# Altium schematic sheet IMU.SchDoc
size A; SheetNumber: 4; SheetTotal: 5
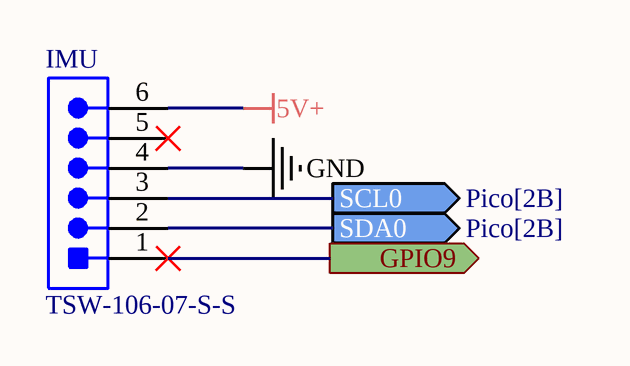
[diagram p0: IMU.SchDoc]

## Parts
IMU  TSW-106-07-S-S  [SMTC-TSW-106-07-S-S_V]

## Ports
GPIO9 (out), SCL0 (out, see Pico[2B]), SDA0 (out, see Pico[2B])

## Nets
5V+: IMU.6
GND: IMU.4
GPIO9: IMU.1 ; port GPIO9
SCL0: IMU.3 ; port SCL0
SDA0: IMU.2 ; port SDA0

Not connected (* = marked no-connect by the designer): IMU 5*

## Library data of the parts
IMU = CMP-1681-00007-2: Male Header, Pitch 2.54 mm, 1 x 6 Position, Height 8.38 mm, Tail Length 2.54 mm, -55 to 125 degC, RoHS, Bulk; Manufacturer: Samtec; Rows: 1; Contact Finish: Gold; Lead Pitch: 0.1 inch; Package Quantity: 1; Mounting Technology: Through Hole; ComponentLink1Description: Manufacturer URL; Contact Plating: Gold; DatasheetVersion: 12/2015; ComponentLink3Description: Package Specification; PackageDescription: Male Header, Pitch 2.54 mm, 1 x 6 Position, Height 8.38 mm, Tail Length 2.54 mm; Height: 8.38 mm; ComponentLink2Description: Datasheet; RoHSCompliant: true; Colour: Black; Packaging: Bulk; Min Operating Temperature: -55 degC; ComponentLink2URL: http://suddendocs.samtec.com/catalog_english/tsw_th.pdf; Mount: Through Hole; PackageReference: TSW-102-07-S-S; Pins: 6; Max Operating Temperature: 125 degC; ComponentLink3URL: http://suddendocs.samtec.com/prints/tsw-xxx-xx-x-x-xx-xxx-footprint.pdf; Length: 15.24 mm; Contact Material: Bronze; ComponentLink1URL: http://www.samtec.com/